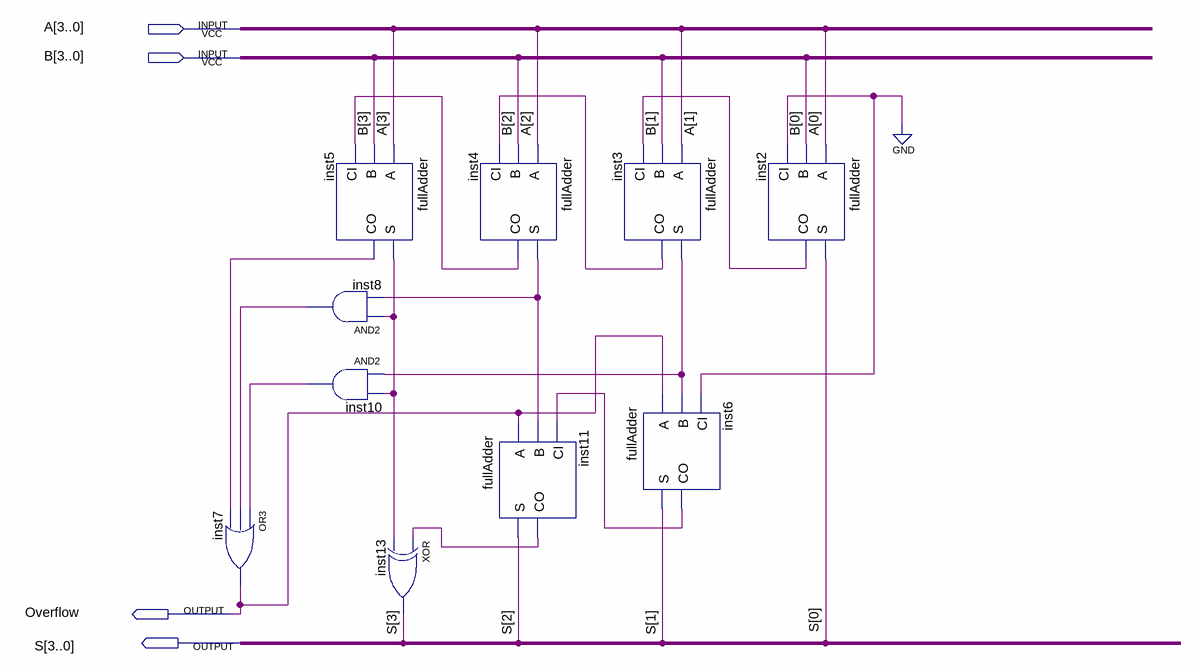
[diagram p0: schematic sheet]
// Quartus schematic SomadorBCD.bdf as structural Verilog: 10 symbols, 4 pins
module SomadorBCD (
  input  [3:0] A,
  input  [3:0] B,
  output Overflow,
  output [3:0] S
);

  wire inst2_co, inst3_co, inst3_s, inst4_co, inst4_s, inst5_co, inst5_s, inst6_co, inst8_out, inst10_out,
       inst11_co;

  or inst7 (Overflow, inst10_out, inst8_out, inst5_co);
  fullAdder inst5 (.A(A[3]), .B(B[3]), .CI(inst4_co), .S(inst5_s), .CO(inst5_co));
  and inst8 (inst8_out, inst5_s, inst4_s);
  and inst10 (inst10_out, inst3_s, inst5_s);
  xor inst13 (S[3], inst11_co, inst5_s);
  fullAdder inst4 (.A(A[2]), .B(B[2]), .CI(inst3_co), .S(inst4_s), .CO(inst4_co));
  fullAdder inst11 (.A(Overflow), .B(inst4_s), .CI(inst6_co), .S(S[2]), .CO(inst11_co));
  fullAdder inst3 (.A(A[1]), .B(B[1]), .CI(inst2_co), .S(inst3_s), .CO(inst3_co));
  fullAdder inst6 (.A(Overflow), .B(inst3_s), .CI(1'b0), .S(S[1]), .CO(inst6_co));
  fullAdder inst2 (.A(A[0]), .B(B[0]), .CI(1'b0), .S(S[0]), .CO(inst2_co));
endmodule
